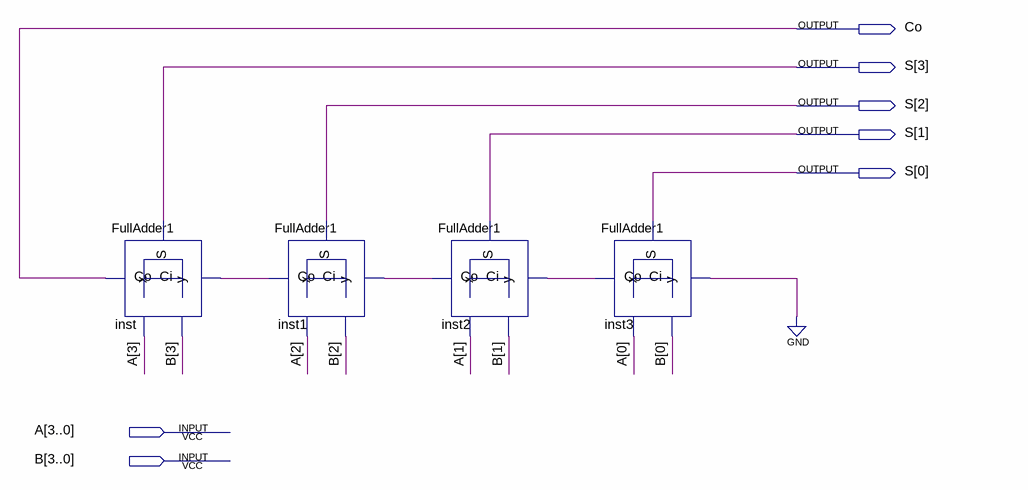
[diagram p0: schematic sheet]
// Quartus schematic FA4.bdf as structural Verilog: 4 symbols, 7 pins
module FA4 (
  input  [3:0] A,
  input  [3:0] B,
  output Co,
  output [3:0] S
);

  wire inst1_co, inst2_co, inst3_co;

  FullAdder1 inst (.Ci(inst1_co), .x(A[3]), .y(B[3]), .S(S[3]), .Co(Co));
  FullAdder1 inst1 (.Ci(inst2_co), .x(A[2]), .y(B[2]), .S(S[2]), .Co(inst1_co));
  FullAdder1 inst2 (.Ci(inst3_co), .x(A[1]), .y(B[1]), .S(S[1]), .Co(inst2_co));
  FullAdder1 inst3 (.Ci(1'b0), .x(A[0]), .y(B[0]), .S(S[0]), .Co(inst3_co));
endmodule
